# EasyEDA schematic SCH_FSR Amplifier_2023-05-21.json
TITLE: FSR Non-Inverting Amplifier; REV: 1.0; Date: 2023-05-09; Sheet: 1/1; Drawn By: David Such; Company: Reefwing Software
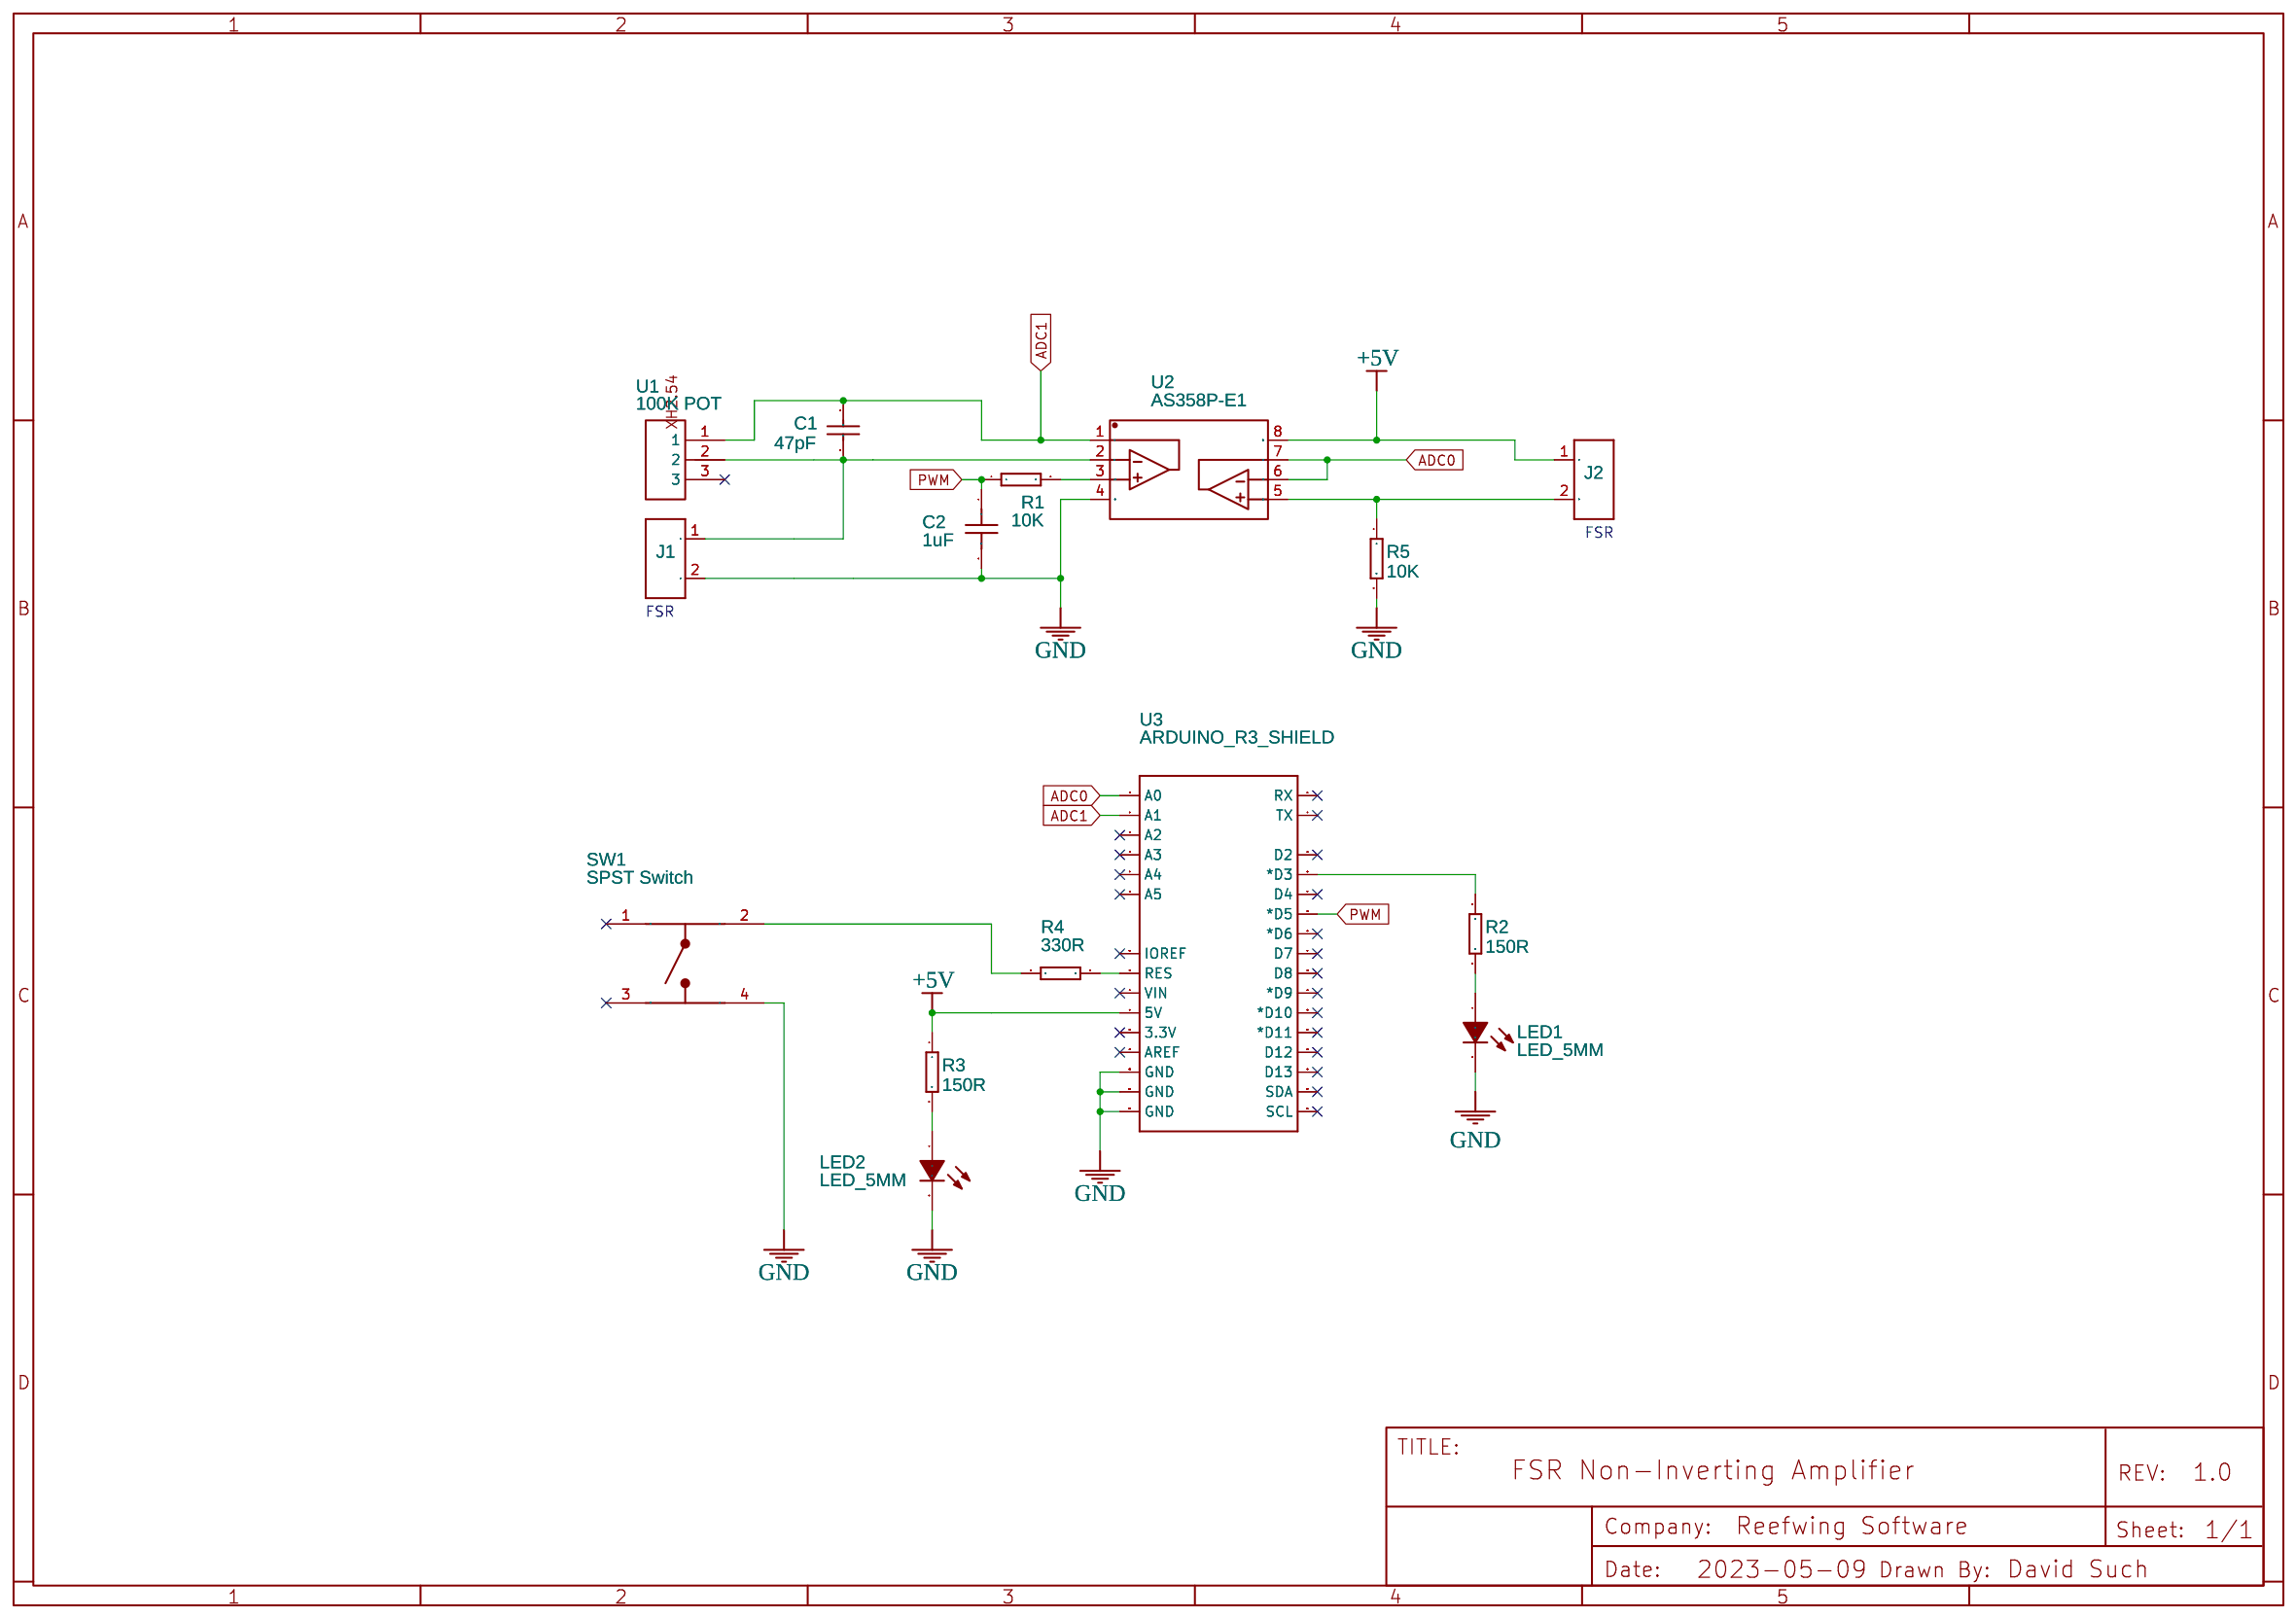
[diagram p0: schematic sheet]

## Parts
C1  47pF  [CAP-TH_L5.0-W4.0-P5.00-D1.0]
C2  1uF  [CAP-TH_L17.0-W8.5-P15.00-D1.2-FD]
J1  Screw Terminal  [H2-5.0-10.5X8.0MM]
J2  Screw Terminal  [H2-5.0-10.5X8.0MM]
LED1  LED_5MM  [LED-TH_BD5.0-P2.54-FD_C9900023552]
LED2  LED_5MM  [LED-TH_BD5.0-P2.54-FD_C9900023552]
R1  10K  [RTH025W]
R2  150R  [RTH025W]
R3  150R  [RTH025W]
R4  330R  [RTH025W]
R5  10K  [RTH025W]
SW1  SPST Switch  [SP0609]
U1  100K POT  [XH2.54_3PIN]
U2  AS358P-E1  [DIP-8_L9.8-W6.6-P2.54-LS7.6-BL]
U3  ARDUINO_R3_SHIELD  [UNO_R3_SHIELD_NOLABELS]

## Library data of the parts
C1 = Ceramic capacitors47PF 3KV: Supplier: LCSC; Manufacturer: ReliaPro; Supplier Part: C19375; JLCPCB Part Class: Extended Part
C2 = 1uf/250V/CBBCapacitor: Supplier Part: C29321; Supplier: LCSC; Manufacturer: ReliaPro
J1 J2 = Screw Terminal: Manufacturer Part: ?
LED1 LED2 = LED_5MM: Supplier: LCSC; Supplier Part: C9900023552; Manufacturer: null; JLCPCB Part Class: Extended Part; Contributor: lcsc
R1-R5 = RESISTOR: Contributor: DangerousPrototype
SW1 = SPST PCB Mount Tactile Switch Round: Manufacturer Part: TC-12EA; Supplier: Jaycar; link: https://www.jaycar.com.au/medias/sys_master/images/images/9687972708382/SP0609-dataSheetMain.jpg; Contributor: reefwing
U1 = XH2.54_3_PIn_Connector: Manufacturer Part: New SchematicLib; Contributor: Sergeybond97
U2 = AS358P-E1: Supplier: LCSC; Supplier Part: C69130; Manufacturer: DIODES(美台); Contributor: LCSC; JLCPCB Part Class: Extended Part
U3 = ARDUINO_R3_SHIELD: Contributor: SparkFun; Package Display: No

## Nets
+5V: J2.1 R3.1 U2.8(+VS) U3.5V
GND: C2.2 J1.2 LED1.2(K) LED2.2(K) R5.2 SW1.4 U2.4(-VS) U3.GND@0(GND) U3.GND@1(GND) U3.GND@2(GND)
ADC0: U2.6 U2.7 U3.A0
ADC1: C1.1 U1.1 U2.1 U3.A1
PWM: C2.1 R1.1 U3.D5(*D5)
Net-(C1-2): C1.2 J1.1 U1.2 U2.2
Net-(J2-2): J2.2 R5.1 U2.5
Net-(LED1-1): LED1.1(A) R2.2
Net-(LED2-1): LED2.1(A) R3.2
Net-(R1-2): R1.2 U2.3(VDD)
Net-(R2-1): R2.1 U3.D3(*D3)
Net-(R4-1): R4.1 SW1.2
Net-(R4-2): R4.2 U3.RES

Not connected (* = marked no-connect by the designer): SW1 1* 3*; U1 3*; U3 3.3V* A2* A3* A4* A5* AREF* D2* D4* D6(*D6)* D7* D8* D9(*D9)* D10(*D10)* D11(*D11)* D12* D13* IOREF* RX* SCL* SDA* TX* VIN*

## Notes on the sheet
- FSR
- FSR
